# Altium schematic sheet Sheet1.SchDoc
size A
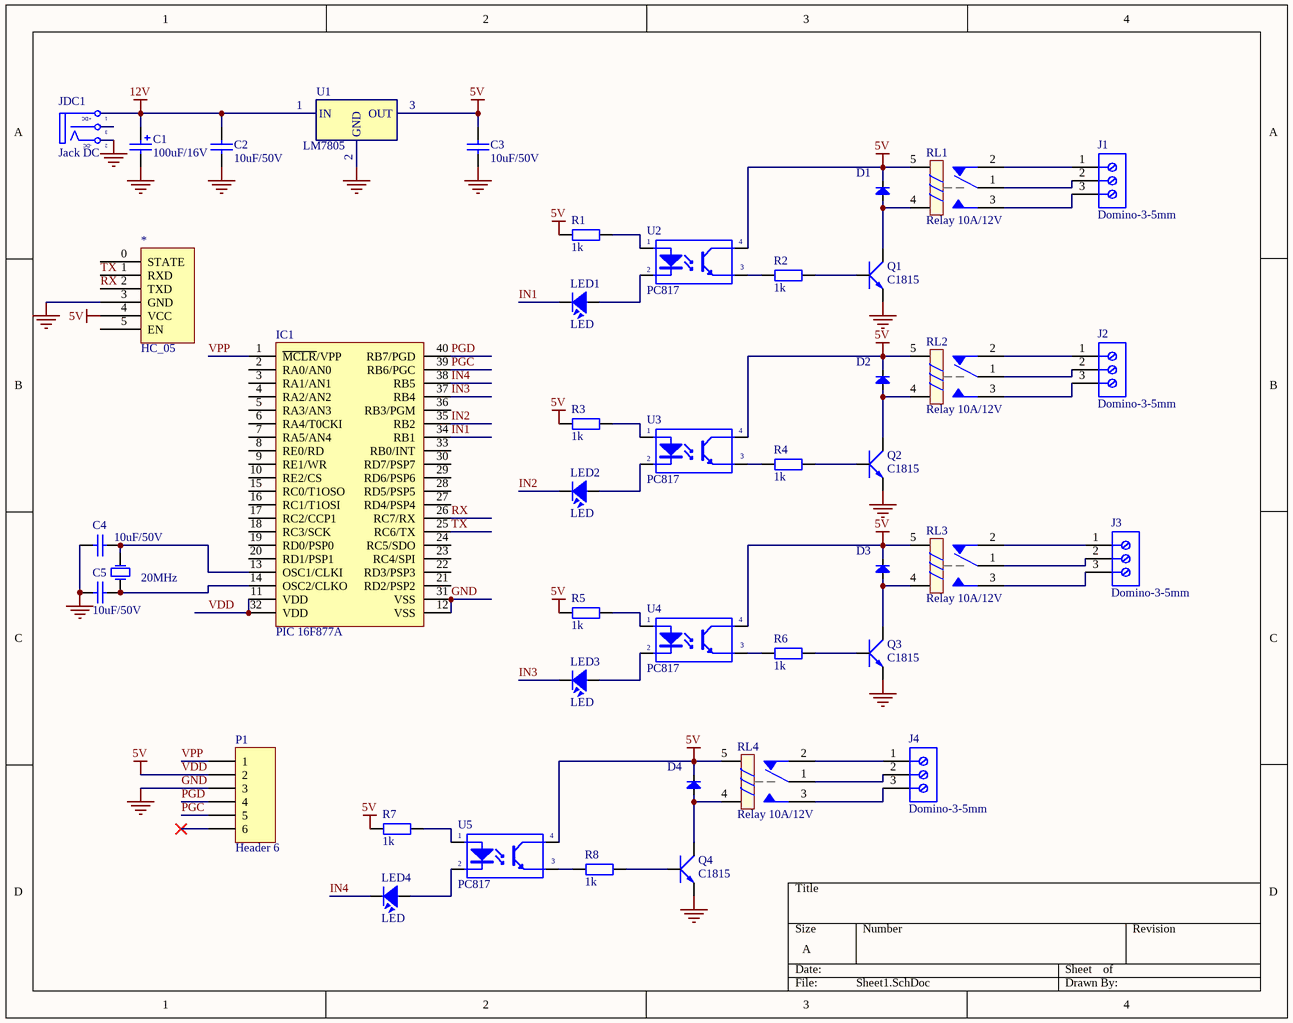
[diagram p0: Sheet1.SchDoc]

## Parts
*  HC_05  [HC_05]
C1  value 100uF/16V  [CAP-SM-AL-SIZE-D-D6L6]  (hidden comment: Cap-Al-100uF-16V-D6L5)
C2  value 10uF/50V  [CAP-SM-0805]  (hidden comment: Cap-10uF-50V-0805)
C3  value 10uF/50V  [CAP-SM-0805]  (hidden comment: Cap-10uF-50V-0805)
C4  value 10uF/50V  [CAP-SM-0805]  (hidden comment: Cap-10uF-50V-0805)
C5  value 10uF/50V  [CAP-SM-0805]  (hidden comment: Cap-10uF-50V-0805)
D1  Diode  [DIO-1A]  (value not drawn)
D2  Diode  [DIO-1A]  (value not drawn)
D3  Diode  [DIO-1A]  (value not drawn)
D4  Diode  [DIO-1A]  (value not drawn)
IC1  PIC 16F877A  [DIP40/W0.6]
J1  Domino-3-5mm  [DOMINO-3-5mm]
J2  Domino-3-5mm  [DOMINO-3-5mm]
J3  Domino-3-5mm  [DOMINO-3-5mm]
J4  Domino-3-5mm  [DOMINO-3-5mm]
JDC1  Jack DC  [JACK-DC]
LED1  LED  [LED-3]
LED2  LED  [LED-3]
LED3  LED  [LED-3]
LED4  LED  [LED-3]
P1  Header 6  [HDR1X6]
Q1  C1815  [QTO-92]
Q2  C1815  [QTO-92]
Q3  C1815  [QTO-92]
Q4  C1815  [QTO-92]
R1  1k  [R1/4W]
R2  1k  [R1/4W]
R3  1k  [R1/4W]
R4  1k  [R1/4W]
R5  1k  [R1/4W]
R6  1k  [R1/4W]
R7  1k  [R1/4W]
R8  1k  [R1/4W]
RL1  Relay 10A/12V  [RL_SPDT_10A]
RL2  Relay 10A/12V  [RL_SPDT_10A]
RL3  Relay 10A/12V  [RL_SPDT_10A]
RL4  Relay 10A/12V  [RL_SPDT_10A]
U1  LM7805  [QTO-220]
U2  PC817  [DIP4/W0.3]
U3  PC817  [DIP4/W0.3]
U4  PC817  [DIP4/W0.3]
U5  PC817  [DIP4/W0.3]
Y1  20MHz  [XTAL]

## Nets
12V: C1.1 C2.2 JDC1.1(T) U1.1(IN)
GND: *.3(GND) C1.2 C2.1 C3.1 C4.2 C5.2 IC1.12(VSS) IC1.31(VSS) JDC1.2(TN) P1.3 Q1.1(E) Q2.1(E) Q3.1(E) Q4.1(E) U1.2(GND)
VDD: *.4(VCC) C3.2 D1.2(K) D2.2(K) D3.2(K) D4.2(K) IC1.11(VDD) IC1.32(VDD) P1.2 R1.1 R3.1 R5.1 R7.1 RL1.5 RL2.5 RL3.5 RL4.5 U1.3(OUT) U2.4(C) U3.4(C) U4.4(C) U5.4(C)  [also labelled 5V]
IN1: IC1.34(RB1) LED1.2
IN2: IC1.35(RB2) LED2.2
IN3: IC1.37(RB4) LED3.2
IN4: IC1.38(RB5) LED4.2
PGC: IC1.39(RB6/PGC) P1.5
PGD: IC1.40(RB7/PGD) P1.4
RX: *.2(TXD) IC1.26(RC7/RX)
TX: *.1(RXD) IC1.25(RC6/TX)
VPP: IC1.1(~{MCLR}/VPP) P1.1
NetC4_1: C4.1 IC1.13(OSC1/CLKI) Y1.2(OSC2)
NetC5_1: C5.1 IC1.14(OSC2/CLKO) Y1.1(OSC1)
NetD1_1: D1.1(A) Q1.2(C) RL1.4
NetD2_1: D2.1(A) Q2.2(C) RL2.4
NetD3_1: D3.1(A) Q3.2(C) RL3.4
NetD4_1: D4.1(A) Q4.2(C) RL4.4
NetJ1_1: J1.1 RL1.2
NetJ1_2: J1.2 RL1.1
NetJ1_3: J1.3 RL1.3
NetJ2_1: J2.1 RL2.2
NetJ2_2: J2.2 RL2.1
NetJ2_3: J2.3 RL2.3
NetJ3_1: J3.1 RL3.2
NetJ3_2: J3.2 RL3.1
NetJ3_3: J3.3 RL3.3
NetJ4_1: J4.1 RL4.2
NetJ4_2: J4.2 RL4.1
NetJ4_3: J4.3 RL4.3
NetLED1_1: LED1.1 U2.2(K)
NetLED2_1: LED2.1 U3.2(K)
NetLED3_1: LED3.1 U4.2(K)
NetLED4_1: LED4.1 U5.2(K)
NetQ1_3: Q1.3(B) R2.2
NetQ2_3: Q2.3(B) R4.2
NetQ3_3: Q3.3(B) R6.2
NetQ4_3: Q4.3(B) R8.2
NetR1_2: R1.2 U2.1(A)
NetR2_1: R2.1 U2.3(E)
NetR3_2: R3.2 U3.1(A)
NetR4_1: R4.1 U3.3(E)
NetR5_2: R5.2 U4.1(A)
NetR6_1: R6.1 U4.3(E)
NetR7_2: R7.2 U5.1(A)
NetR8_1: R8.1 U5.3(E)

Not connected (* = marked no-connect by the designer): * 0(STATE) 5(EN); IC1 2(RA0/AN0) 3(RA1/AN1) 4(RA2/AN2) 5(RA3/AN3) 6(RA4/T0CKI) 7(RA5/AN4) 8(RE0/RD) 9(RE1/WR) 10(RE2/CS) 15(RC0/T1OSO) 16(RC1/T1OSI) 17(RC2/CCP1) 18(RC3/SCK) 19(RD0/PSP0) 20(RD1/PSP1) 21(RD2/PSP2) 22(RD3/PSP3) 23(RC4/SPI) 24(RC5/SDO) 27(RD4/PSP4) 28(RD5/PSP5) 29(RD6/PSP6) 30(RD7/PSP7) 33(RB0/INT) 36(RB3/PGM); JDC1 3(S); P1 6*

## Notes on the sheet
- (in symbol Jack DC) +DC; -DC

## Library data of the parts
C1 = Cap-Al-100uF-16V-D6L5: CAP ALUM 100UF 20% 16V SMD; Manufacturer: Nichicon; Manufacturer Part Number: UWX1C101MCL1GB; Local Supplier: thegioiic; Local Supplier Link: https://thegioiic.com/products/tu-nhom-smd-100uf-16v-d6-3l5-4; Supplier 1: Digikey; Supplier 1 Part Number: 493-2105-1-ND; Supplier 1 Link: https://www.digikey.com/product-detail/en/nichicon/UWX1C101MCL1GB/493-2105-1-ND/590080
C2-C5 = Cap-10uF-50V-0805: CAP CER 10UF 50V X5R 0805; Manufacturer: Yageo; Manufacturer Part Number: CC0805KKX5R9BB106; Local Supplier: thegioiic; Local Supplier Link: https://thegioiic.com/products/tu-10uf-50v-0805; Supplier 1: Digikey; Supplier 1 Link: https://www.digikey.com/product-detail/en/yageo/CC0805KKX5R9BB106/311-3499-2-ND/7164383; Supplier 1 Part Number: 311-3499-2-ND
D1-D4 = Diode: Default Diode; Code - JEDEC: DO-214-AB; Value: 1N5007; Published: 8-Jun-2000; Revision: July-2002: Re-released for DXP Platform.; Publisher: Altium Limited
IC1 = PIC16F877-PU: 8K FLASH, 368B RAM, 256B EFROM; Value: DIP 40; Value: PIC16F877A; Copyright by: VanDungEvn
J1-J4 = Domino-3-5mm: WR-TBL Serie 1347 Horizontal Cable Entry, Pressure Clamp, pitch 5mm, 3p; Part Number: 691134710003; Compliance: Lead free / RoHS; Modularity: Yes; PCB/Cable/Panel: PCB; Pin Number: 3; Rated Current [UL]: 16A; Working Voltage [UL]: 300VAC; ComponentLink1Description: Manufacturer; ComponentLink1URL: http://www.we-online.de; ComponentLink2URL: https://katalog.we-online.de/em/datasheet/691134710003.pdf; ComponentLink2Description: Datasheet; Mounting Technology: THT; Packaging: Box; Operating Temperature: -30 to +120degC; Pitch: 5mm; Published Date: October 2019; Type: Horizontal; Publisher: Wurth Elektronik; Application: Pressure Clamp
JDC1 = Jack DC: Jack DC input; Value: Jac DC
LED1-LED4 = LED: LED Single colour Green and Red; Value: LED 3 ly Single Colour
P1 = Header 6: Header, 6-Pin; LatestRevisionDate: 17-Jul-2002; LatestRevisionNote: Re-released for DXP Platform.; Publisher: Altium Limited
Q1-Q4 = C1815: NPN 600mW, ECB; Value: C1815
R1-R8 = R1/4W: Resistor 1/4W; Value: R1/4W - 1K
RL1-RL4 = Relay 1: Relay SPDT,10A - 12VDC 5 Pin; Value: Relay SPDT, 10A, 12V
U1 = LM7805: Positive Voltage Regulator
U2-U5 = PC817: Single Opto; Value: PC817
Y1 = XTAL: Crystal Oscillator; Published: 8-Jun-2000; LatestRevisionDate: 17-Jul-2002; LatestRevisionNote: Re-released for DXP Platform.; PackageReference: R38; Publisher: Altium Limited